# Altium schematic sheet Circuito.SchDoc
size A4
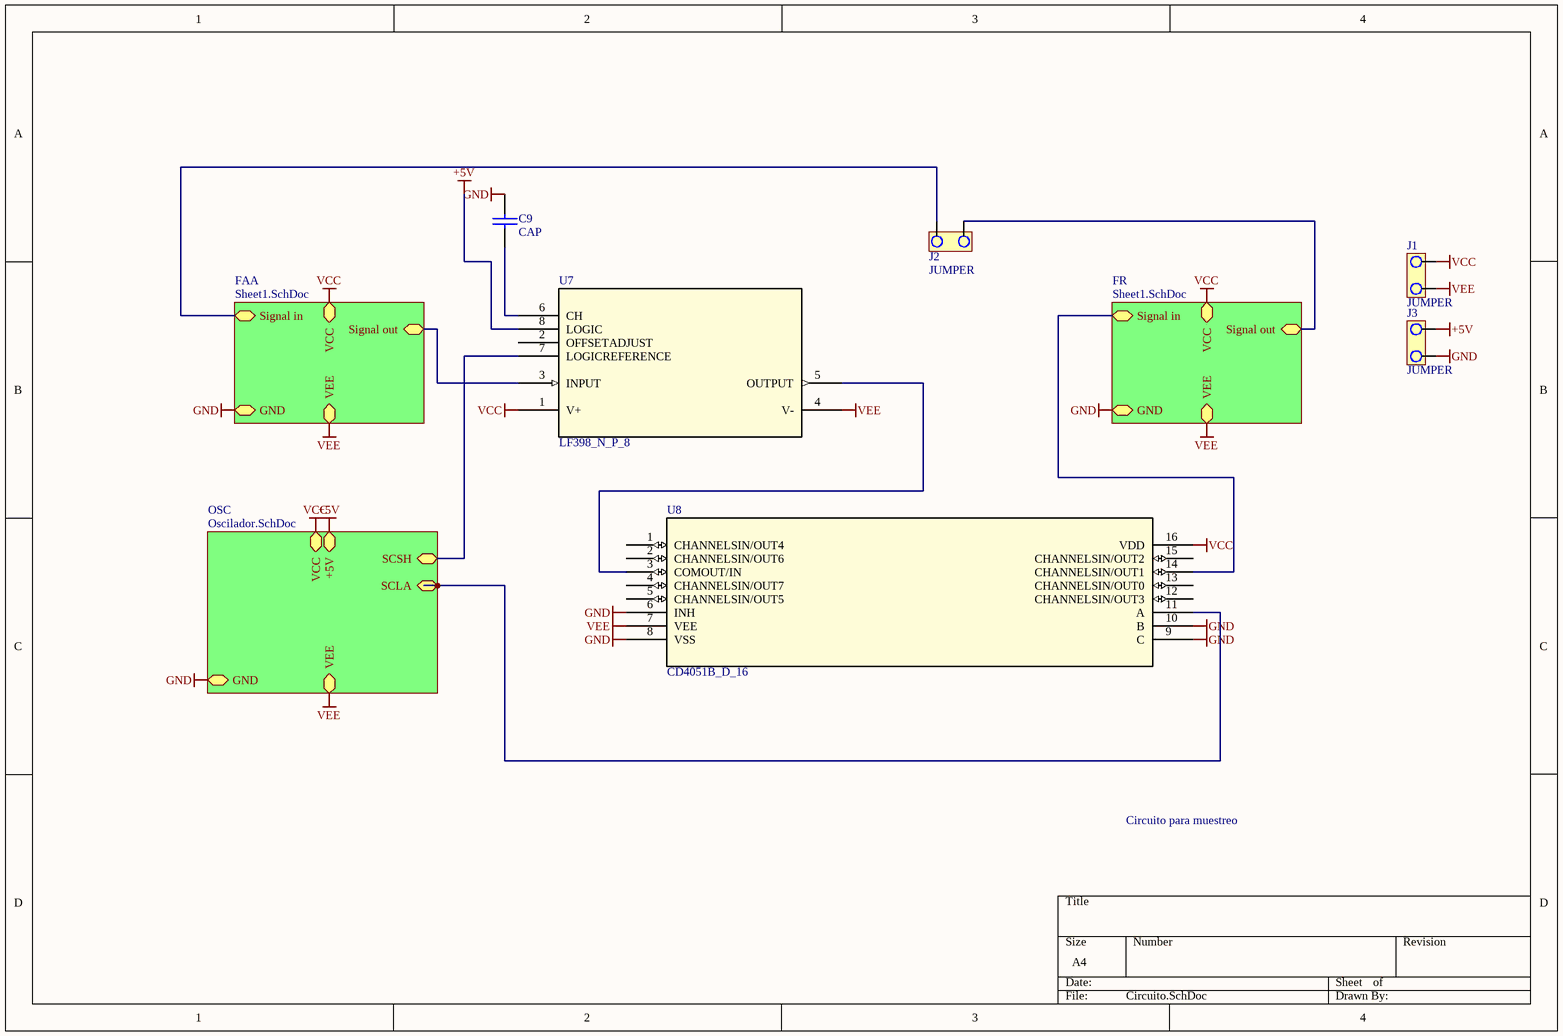
[diagram p0: Circuito.SchDoc]

## Parts
C9  CAP  [CAP100]
J1  JUMPER  [JUMPER2]
J2  JUMPER  [JUMPER2]
J3  JUMPER  [JUMPER2]
U7  LF398_N_P_8  [P8]
U8  CD4051B_D_16  [D16]

## Sub-sheets
FAA = Sheet1.SchDoc: Signal in, Signal out, GND, VEE, VCC
FR = Sheet1.SchDoc: Signal in, Signal out, GND, VEE, VCC
OSC = Oscilador.SchDoc: SCLA, SCSH, GND, +5V, VEE, VCC

## Nets
+5V: J3.1 U7.8(LOGIC) ; sheet OSC/+5V
GND: C9.1 J3.2 U8.6(INH) U8.8(VSS) U8.9(C) U8.10(B) ; sheet FAA/GND, sheet FR/GND, sheet OSC/GND
VCC: J1.1 U7.1(V+) U8.16(VDD) ; sheet FAA/VCC, sheet FR/VCC, sheet OSC/VCC
VEE: J1.2 U7.4(V-) U8.7(VEE) ; sheet FAA/VEE, sheet FR/VEE, sheet OSC/VEE
NetC9_2: C9.2 U7.6(CH)
NetJ2_1: J2.1 ; sheet FAA/Signal in
NetJ2_2: J2.2 ; sheet FR/Signal out
NetU7_3: U7.3(INPUT) ; sheet FAA/Signal out
NetU7_5: U7.5(OUTPUT) U8.3(COMOUT/IN)
NetU7_7: U7.7(LOGICREFERENCE) ; sheet OSC/SCSH
NetU8_11: U8.11(A) ; sheet OSC/SCLA
NetU8_14: U8.14(CHANNELSIN/OUT1) ; sheet FR/Signal in

Not connected (* = marked no-connect by the designer): U7 2(OFFSETADJUST); U8 1(CHANNELSIN/OUT4) 2(CHANNELSIN/OUT6) 4(CHANNELSIN/OUT7) 5(CHANNELSIN/OUT5) 12(CHANNELSIN/OUT3) 13(CHANNELSIN/OUT0) 15(CHANNELSIN/OUT2)

## Notes on the sheet
- Circuito para muestreo

## Library data of the parts
U7 = LF398_N_P_8: Imported; Manufacturer_Part_Number: lf398-n_p_8; Vendor: Texas Instruments; Value: Value; Type: Type; RefDes: RefDes
U8 = CD4051B_D_16: Imported; Manufacturer: Texas Instruments; INDUSTRY_STD_PKG_TYPE: SOIC; FAMILY_NAME: ANALOG SWITCH/MULTIPLEXER (greater than 5V); PIN_COUNT: 16; PACKAGE_DESIGNATOR: D; Datasheet_URL: http://www.ti.com/lit/gpn/CD4051B; GENERIC_PART_NUMBER: CD4051B; Value: Value; Type: Type; RefDes: RefDes